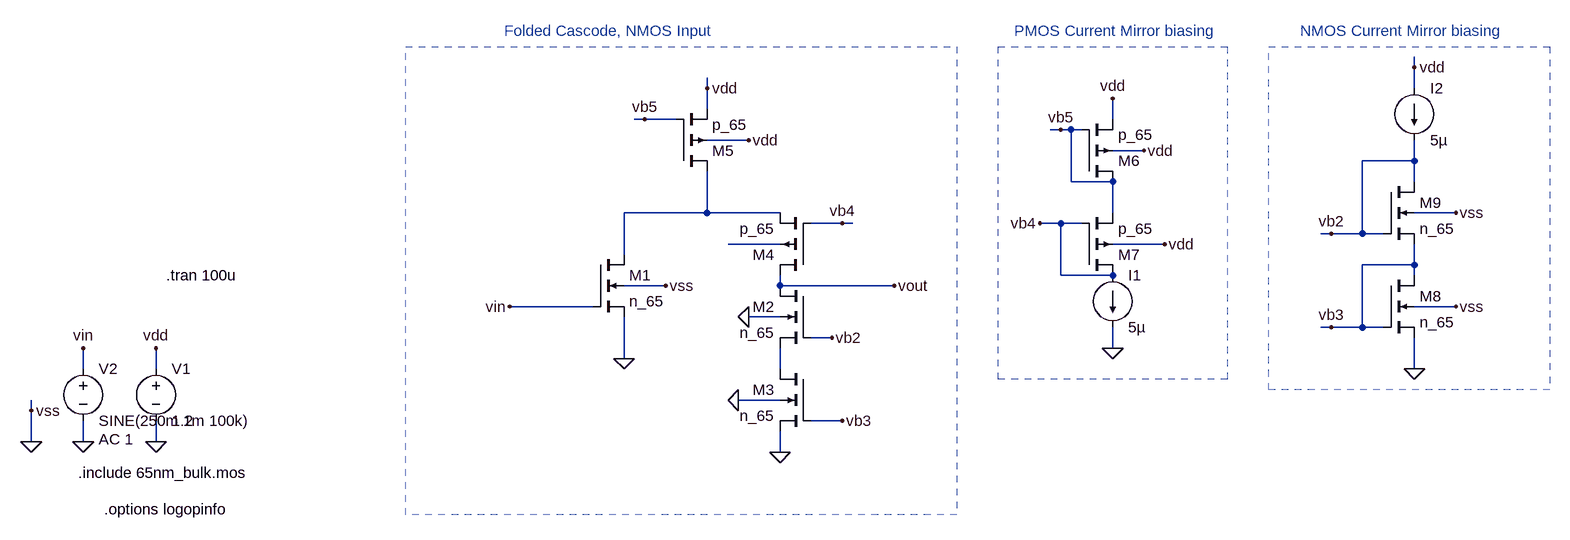
[diagram p0: schematic Folded_Cascode.asc]
Folded_Cascode.asc, the LTspice schematic file:
Version 4.1
SHEET 1 1700 680
WIRE 1488 -272 1488 -288
WIRE 400 -240 400 -256
WIRE 1488 -240 1488 -272
WIRE 400 -208 400 -240
WIRE 304 -192 288 -192
WIRE 352 -192 304 -192
WIRE 1024 -192 1024 -224
WIRE 944 -176 928 -176
WIRE 960 -176 944 -176
WIRE 976 -176 960 -176
WIRE 464 -160 400 -160
WIRE 1072 -144 1024 -144
WIRE 1488 -128 1488 -160
WIRE 1488 -128 1408 -128
WIRE 960 -96 960 -176
WIRE 1024 -96 960 -96
WIRE 1488 -96 1488 -128
WIRE 400 -48 400 -112
WIRE 400 -48 272 -48
WIRE 512 -48 400 -48
WIRE 1024 -48 1024 -96
WIRE 1552 -48 1488 -48
WIRE 608 -32 560 -32
WIRE 624 -32 608 -32
WIRE 944 -32 912 -32
WIRE 976 -32 944 -32
WIRE 1360 -16 1344 -16
WIRE 1408 -16 1408 -128
WIRE 1408 -16 1360 -16
WIRE 1440 -16 1408 -16
WIRE 512 0 432 0
WIRE 1104 0 1024 0
WIRE 272 16 272 -48
WIRE 1488 32 1488 0
WIRE 1488 32 1408 32
WIRE 944 48 944 -32
WIRE 1024 48 944 48
WIRE 1488 48 1488 32
WIRE 336 64 272 64
WIRE 512 64 512 48
WIRE 688 64 512 64
WIRE 224 96 96 96
WIRE 1552 96 1488 96
WIRE 512 112 464 112
WIRE 1360 128 1344 128
WIRE 1408 128 1408 32
WIRE 1408 128 1360 128
WIRE 1440 128 1408 128
WIRE 592 144 560 144
WIRE 1024 160 1024 128
WIRE 272 176 272 112
WIRE -560 192 -560 160
WIRE -448 192 -448 160
WIRE 512 192 512 160
WIRE 1488 192 1488 144
WIRE 512 240 448 240
WIRE -640 256 -640 240
WIRE 608 272 560 272
WIRE -640 304 -640 256
WIRE -560 304 -560 272
WIRE -448 304 -448 272
WIRE 512 320 512 288
FLAG -448 304 0
FLAG -560 304 0
FLAG -560 160 vin
FLAG -448 160 vdd
FLAG 272 176 0
FLAG 464 -160 vdd
FLAG 400 -240 vdd
FLAG 512 320 0
FLAG 448 240 0
FLAG 464 112 0
FLAG 304 -192 vb5
FLAG 608 -32 vb4
FLAG 592 144 vb2
FLAG 608 272 vb3
FLAG 96 96 vin
FLAG 688 64 vout
FLAG 1024 160 0
FLAG 1024 -224 vdd
FLAG 944 -176 vb5
FLAG 1104 0 vdd
FLAG 1072 -144 vdd
FLAG 912 -32 vb4
FLAG -640 304 0
FLAG -640 256 vss
FLAG 336 64 vss
FLAG 1552 96 vss
FLAG 1552 -48 vss
FLAG 1488 -272 vdd
FLAG 1488 192 0
FLAG 1360 128 vb3
FLAG 1360 -16 vb2
SYMBOL voltage -448 176 R0
WINDOW 123 0 0 Left 0
WINDOW 39 0 0 Left 0
SYMATTR InstName V1
SYMATTR Value 1.2
SYMBOL voltage -560 176 R0
WINDOW 123 24 124 Left 2
WINDOW 39 0 0 Left 0
SYMATTR Value2 AC 1
SYMATTR InstName V2
SYMATTR Value SINE(250m 1m 100k)
SYMBOL nmos4 224 16 R0
SYMATTR InstName M1
SYMATTR Value n_65
SYMATTR Value2 l=180n w=10u
SYMBOL pmos4 560 48 R180
SYMATTR InstName M4
SYMATTR Value p_65
SYMATTR Value2 l=200n w=10u
SYMBOL pmos4 352 -112 M180
SYMATTR InstName M5
SYMATTR Value p_65
SYMATTR Value2 l=200n w=10u
SYMBOL nmos4 560 64 M0
SYMATTR InstName M2
SYMATTR Value n_65
SYMATTR Value2 l=200n w=5u
SYMBOL nmos4 560 192 M0
SYMATTR InstName M3
SYMATTR Value n_65
SYMATTR Value2 l=200n w=5u
SYMBOL current 1024 48 R0
WINDOW 123 0 0 Left 0
WINDOW 39 0 0 Left 0
SYMATTR InstName I1
SYMATTR Value 5µ
SYMBOL pmos4 976 -96 M180
SYMATTR InstName M6
SYMATTR Value p_65
SYMATTR Value2 l=200n w=10u
SYMBOL pmos4 976 48 M180
SYMATTR InstName M7
SYMATTR Value p_65
SYMATTR Value2 l=200n w=20u
SYMBOL nmos4 1440 48 R0
SYMATTR InstName M8
SYMATTR Value n_65
SYMATTR Value2 l=200n w=10u
SYMBOL nmos4 1440 -96 R0
SYMATTR InstName M9
SYMATTR Value n_65
SYMATTR Value2 l=200n w=10u
SYMBOL current 1488 -240 R0
WINDOW 123 0 0 Left 0
WINDOW 39 0 0 Left 0
SYMATTR InstName I2
SYMATTR Value 5µ
TEXT -568 352 Left 2 !.include 65nm_bulk.mos
TEXT 88 -328 Left 2 ;Folded Cascode, NMOS Input
TEXT 872 -328 Left 2 ;PMOS Current Mirror biasing
TEXT 1312 -328 Left 2 ;NMOS Current Mirror biasing
TEXT -528 408 Left 2 !.options logopinfo
TEXT -432 48 Left 2 !.tran 100u
RECTANGLE Normal 784 416 -64 -304 2
RECTANGLE Normal 1200 208 848 -304 2
RECTANGLE Normal 1696 224 1264 -304 2

The netlist it stands for:
* Folded_Cascode.asc
V1 vdd 0 1.2
V2 vin 0 SINE(250m 1m 100k) AC 1
M1 N001 vin 0 0 n_65 l=180n w=10u
M4 vout vb4 N001 N002 p_65 l=200n w=10u
M5 N001 vb5 vdd vdd p_65 l=200n w=10u
M2 vout vb2 N003 0 n_65 l=200n w=5u
M3 N003 vb3 0 0 n_65 l=200n w=5u
I1 vb4 0 5µ
M6 vb5 vb5 vdd vdd p_65 l=200n w=10u
M7 vb4 vb4 vb5 vdd p_65 l=200n w=20u
M8 vb3 vb3 0 0 n_65 l=200n w=10u
M9 vb2 vb2 vb3 0 n_65 l=200n w=10u
I2 vdd vb2 5µ
.model NMOS NMOS
.model PMOS PMOS
.lib standard.mos
.include 65nm_bulk.mos
* Folded Cascode, NMOS Input
* PMOS Current Mirror biasing
* NMOS Current Mirror biasing
.options logopinfo
.tran 100u
.backanno
.end